# EAGLE schematic BoosterHC HAT V0_1 (EAGLE 8.1.0)
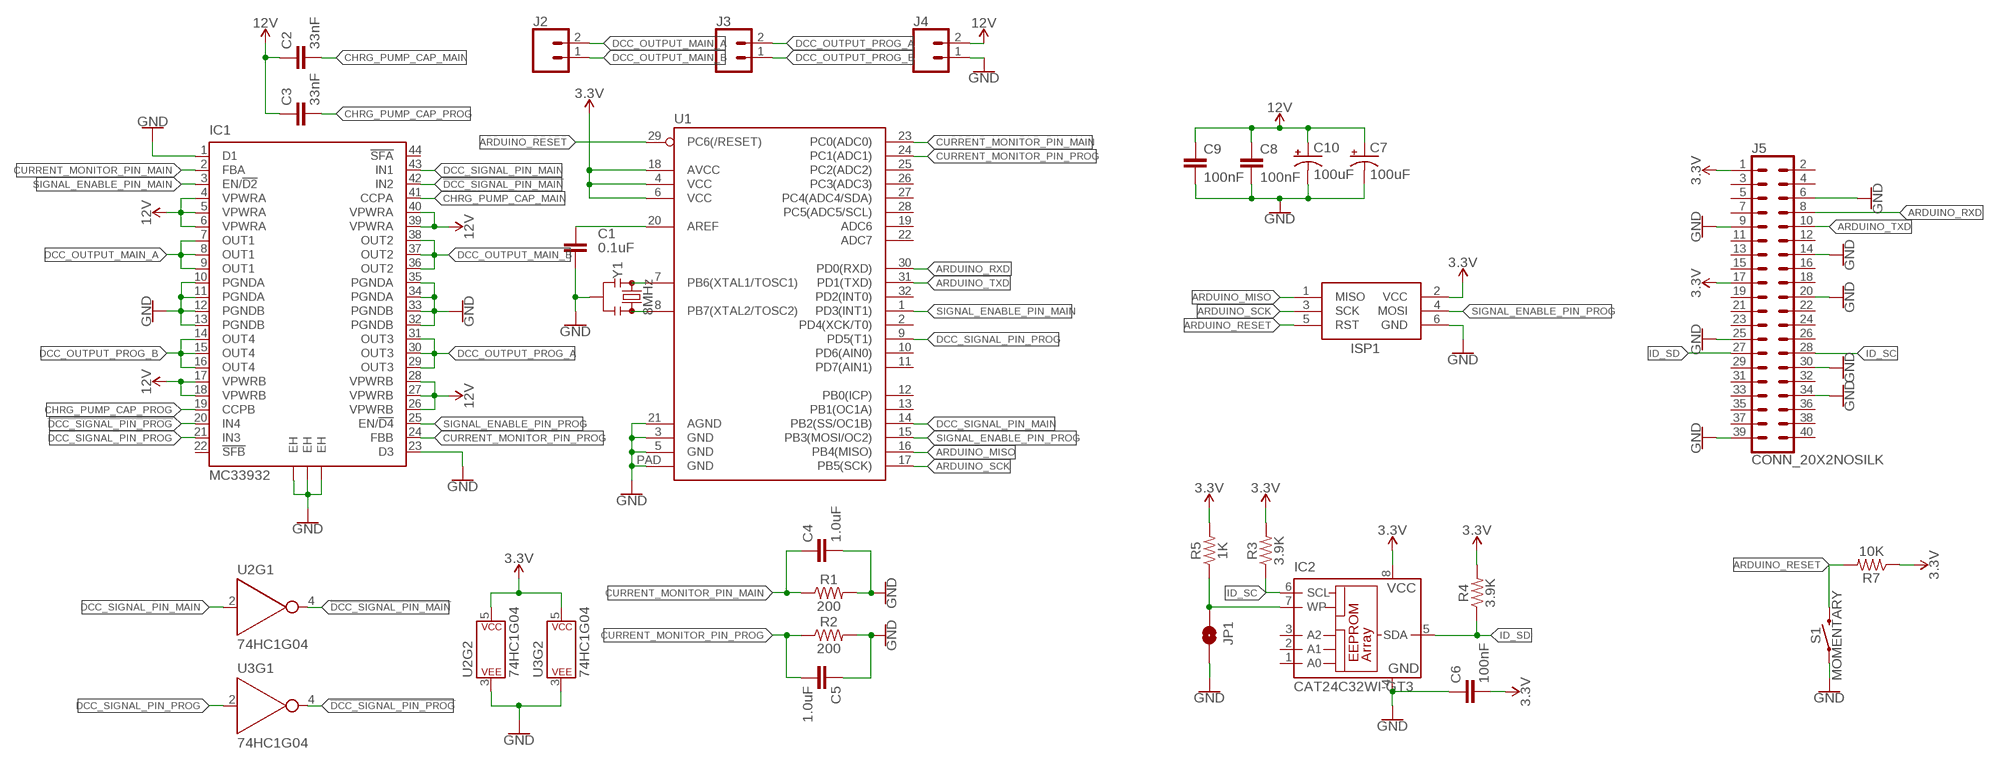
[diagram p0: schematic, sheet 1]

## Parts
C1  0.1uF  0.1UF-0603-25V-5%  [0603]
C2  33nF  33NF-0603-50V-10%  [0603]
C3  33nF  33NF-0603-50V-10%  [0603]
C4  1.0uF  1.0UF-0603-16V-10%  [0603]
C5  1.0uF  1.0UF-0603-16V-10%  [0603]
C6  100nF  33NF-0603-50V-10%  [0603]
C7  100uF  100UF-POLAR-25V-20%(ELEC)  [PANASONIC_D]
C8  100nF  47NF-0603-25V-5%  [0603]
C9  100nF  47NF-0603-25V-5%  [0603]
C10  100uF  100UF-POLAR-25V-20%(ELEC)  [PANASONIC_D]
IC1  MC33932  [HSOP44]
IC2  CAT24C32WI-GT3  24C32ASN  [SO-08]
ISP1  AVRISP-6  [AVRISP]
J2  CONN_025MM  [SCREWTERMINAL-5MM-2]
J3  CONN_025MM  [SCREWTERMINAL-5MM-2]
J4  CONN_025MM  [SCREWTERMINAL-5MM-2]
J5  CONN_20X2NOSILK  [2X20_NOSILK]
JP1  JUMPER-SMT_2_NO_SILK  [SMT-JUMPER_2_NO_SILK]
R1  200  200OHM-0603-1/10W-1%  [0603]
R2  200  200OHM-0603-1/10W-1%  [0603]
R3  3.9K  200OHM-0603-1/10W-1%  [0603]
R4  3.9K  200OHM-0603-1/10W-1%  [0603]
R5  1K  200OHM-0603-1/10W-1%  [0603]
R7  10K  200OHM-0603-1/10W-1%  [0603]
S1  MOMENTARY  MOMENTARY-SWITCH-SPST-SMD-5.2-REDUNDANT  [TACTILE_SWITCH_SMD_5.2MM]
U1  ATMEGA328P_MLFMLF32  [MLF32-PAD]
U2  74HC1G04  [SOT353]
U3  74HC1G04  [SOT353]
Y1  8MHz  RESONATOR-8MHZSMD_3.2X1.3  [RESONATOR-SMD-3.2X1.3]

## Nets
3.3V: C6.2 IC2.8(VCC) ISP1.2(VCC) J5.1 J5.17 R3.2 R4.2 R5.2 R7.1 U1.4(VCC) U1.6(VCC) U1.18(AVCC) U2.5(P$V+) U3.5(P$V+)
12V: C2.1 C3.1 C7.+ C8.1 C9.1 C10.+ IC1.4(VPWRA) IC1.5(VPWRA) IC1.6(VPWRA) IC1.17(VPWRB) IC1.18(VPWRB) IC1.26(VPWRB) IC1.27(VPWRB) IC1.28(VPWRB) IC1.39(VPWRA) IC1.40(VPWRA) J4.2
!DCC_SIGNAL_PIN_MAIN: IC1.42(IN2) U2.4(Y)
!DCC_SIGNAL_PIN_PROG: IC1.20(IN4) U3.4(Y)
ARDUINO_MISO: ISP1.1(MISO) U1.16(PB4(MISO))
ARDUINO_RESET: ISP1.5(RST) R7.2 S1.3 S1.4 U1.29(PC6(/RESET))
ARDUINO_RXD: J5.8 U1.30(PD0(RXD))
ARDUINO_SCK: ISP1.3(SCK) U1.17(PB5(SCK))
ARDUINO_TXD: J5.10 U1.31(PD1(TXD))
CHRG_PUMP_CAP_MAIN: C2.2 IC1.41(CCPA)
CHRG_PUMP_CAP_PROG: C3.2 IC1.19(CCPB)
CURRENT_MONITOR_PIN_MAIN: C4.1 IC1.2(FBA) R1.1 U1.23(PC0(ADC0))
CURRENT_MONITOR_PIN_PROG: C5.2 IC1.24(FBB) R2.1 U1.24(PC1(ADC1))
DCC_OUTPUT_MAIN_A: IC1.7(OUT1) IC1.8(OUT1) IC1.9(OUT1) J2.2
DCC_OUTPUT_MAIN_B: IC1.36(OUT2) IC1.37(OUT2) IC1.38(OUT2) J2.1
DCC_OUTPUT_PROG_A: IC1.29(OUT3) IC1.30(OUT3) IC1.31(OUT3) J3.2
DCC_OUTPUT_PROG_B: IC1.14(OUT4) IC1.15(OUT4) IC1.16(OUT4) J3.1
DCC_SIGNAL_PIN_MAIN: IC1.43(IN1) U1.14(PB2(SS/OC1B)) U2.2(A)
DCC_SIGNAL_PIN_PROG: IC1.21(IN3) U1.9(PD5(T1)) U3.2(A)
GND: C1.2 C4.2 C5.1 C6.1 C7.- C8.2 C9.2 C10.- IC1.1(D1) IC1.10(PGNDA) IC1.11(PGNDA) IC1.12(PGNDB) IC1.13(PGNDB) IC1.23(D3) IC1.32(PGNDB) IC1.33(PGNDB) IC1.34(PGNDA) IC1.35(PGNDA) IC1.EH@1(EH) IC1.EH@2(EH) IC1.EH@3(EH) IC2.4(GND) ISP1.6(GND) J4.1 J5.6 J5.9 J5.14 J5.20 J5.25 J5.30 J5.34 J5.39 JP1.2 R1.2 R2.2 S1.1 S1.2 U1.3(GND) U1.5(GND) U1.21(AGND) U1.PAD(GND) U2.3(P$V-) U3.3(P$V-) Y1.2
ID_SC: IC2.6(SCL) J5.28 R3.1
ID_SD: IC2.5(SDA) J5.27 R4.1
N$4: IC2.7(WP) JP1.1 R5.1
N$7: U1.8(PB7(XTAL2/TOSC2)) Y1.3
N$8: U1.7(PB6(XTAL1/TOSC1)) Y1.1
N$9: C1.1 U1.20(AREF)
SIGNAL_ENABLE_PIN_MAIN: IC1.3(EN/!D2) U1.1(PD3(INT1))
SIGNAL_ENABLE_PIN_PROG: IC1.25(EN/!D4) ISP1.4(MOSI) U1.15(PB3(MOSI/OC2))
Unconnected: IC1.22(!SFB) IC1.44(!SFA) IC2.1(A0) IC2.2(A1) IC2.3(A2) J5.2 J5.3 J5.4 J5.5 J5.7 J5.11 J5.12 J5.13 J5.15 J5.16 J5.18 J5.19 J5.21 J5.22 J5.23 J5.24 J5.26 J5.29 J5.31 J5.32 J5.33 J5.35 J5.36 J5.37 J5.38 J5.40 U1.2(PD4(XCK/T0)) U1.10(PD6(AIN0)) U1.11(PD7(AIN1)) U1.12(PB0(ICP)) U1.13(PB1(OC1A)) U1.19(ADC6) U1.22(ADC7) U1.25(PC2(ADC2)) U1.26(PC3(ADC3)) U1.27(PC4(ADC4/SDA)) U1.28(PC5(ADC5/SCL)) U1.32(PD2(INT0))

## Library data of the parts
C1 = SparkFun-Capacitors:0.1UF: 0.1µF ceramic capacitors A capacitor is a passive two-terminal electrical component used to store electrical energy temporarily in an electric field.; PROD_ID: CAP-08604
C2 C3 = SparkFun-Capacitors:33NF: 33nF ceramic capacitors A capacitor is a passive two-terminal electrical component used to store electrical energy temporarily in an electric field.; PROD_ID: CAP-07887
C4 C5 = SparkFun-Capacitors:1.0UF: 1µF ceramic capacitors A capacitor is a passive two-terminal electrical component used to store electrical energy temporarily in an electric field.; PROD_ID: CAP-00868
C6 = SparkFun-Capacitors:33NF: 33nF ceramic capacitors A capacitor is a passive two-terminal electrical component used to store electrical energy temporarily in an electric field.; PROD_ID: CAP-07887; VALUE: 33nF
C7 C10 = SparkFun-Capacitors:100UF-POLAR: 100µF polarized capacitors A capacitor is a passive two-terminal electrical component used to store electrical energy temporarily in an electric field.; PROD_ID: CAP-12547
C8 C9 = SparkFun-Capacitors:47NF: 47nF ceramic capacitors A capacitor is a passive two-terminal electrical component used to store electrical energy temporarily in an electric field.; PROD_ID: CAP-08605; VALUE: 47nF
IC1 = freescale:MC33932: 5.0 A Throttle Control H-Bridge Auto generated by make-symbol-device-package-bsdl.ulp Rev. 33 Source: http://www.freescale.com/files/analog/doc/data_sheet/MC33932.pdf?fpsp=1; MPN: MC33932VW; OC_FARNELL: 1701639; OC_NEWARK: 67P3304
IC2 = microchip:24*: Serial EEPROM I2C; MPN: IS24C32A-2GLI; OC_FARNELL: 1224413; OC_NEWARK: 43M4588
ISP1 = adafruit:AVRISP: AVR ISP HEADER Standard 6 pin header for AVR programming
J2-J4 = SparkFun-Connectors:CONN_02: Multi connection point. Often used as Generic Header-pin footprint for 0.1 inch spaced/style header connections On any of the 0.1 inch spaced packages, you can populate with these: Break Away Headers - Straight <https://www.sparkfun.com/products/116> (PRT-00116) Break Away Male Headers - Right Angle <https://www.sparkfun.com/products/553> (PRT-00553) Female Headers <https://www.sparkfun.com/products/115> (PRT-00115) Break Away Headers - Machine Pin <https://www.sparkfun.com/products/117> (PRT-00117) Break Away Female Headers - Swiss Machine Pin <https://www.sparkfun.com/products/743> (PRT-00743) For SCREWTERMINALS and SPRING TERMINALS visit here: Screw Terimnals on SparkFun.com <https://www.sparkfun.com/search/results?term=Screw+Terminals> (5mm/3.5mm/2.54mm spacing) This device is also useful as a general connection point to wire up your design to another part of your project. Our various solder wires solder well into these plated through hole pads. Hook-Up Wire - Assortment (Stranded, 22 AWG) <https://www.sparkfun.com/products/11375> (PRT-11375) Hook-Up Wire - Assortment (Solid Core, 22 AWG) <https://www.sparkfun.com/products/11367> (PRT-11367) View the entire wire category on our website here <https://www.sparkfun.com/categories/141> Special notes: Molex polarized connector foot print use with: PRT-08233 with associated crimp pins and housings. 2.54_SCREWTERM for use with PRT-10571. 3.5mm Screw Terminal footprints for PRT-08084 5mm Screw Terminal footprints for use with PRT-08432; SF_SKU: PRT-08432
J5 = SparkFun-Connectors:CONN_20X2: Multi connection point. Often used as Generic Header-pin footprint for 0.1 inch spaced/style header connections On any of the 0.1 inch spaced packages, you can populate with these: Break Away Headers - Straight <https://www.sparkfun.com/products/116> (PRT-00116) Break Away Male Headers - Right Angle <https://www.sparkfun.com/products/553> (PRT-00553) Female Headers <https://www.sparkfun.com/products/115> (PRT-00115) Break Away Headers - Machine Pin <https://www.sparkfun.com/products/117> (PRT-00117) Break Away Female Headers - Swiss Machine Pin <https://www.sparkfun.com/products/743> (PRT-00743)
JP1 = SparkFun-Jumpers:JUMPER-SMT_2_NO: Normally open jumper This jumper has two pads in close proximity to each other. Apply solder to close the connection. Round pads are easier to solder for beginners, but are a lot larger. SparkFun Product that uses the round pads: SparkFun EL Sequencer <https://www.sparkfun.com/products/12781>
R1 R2 = SparkFun-Resistors:200OHM: 200Ω resistor A resistor is a passive two-terminal electrical component that implements electrical resistance as a circuit element. Resistors act to reduce current flow, and, at the same time, act to lower voltage levels within circuits. - Wikipedia; PROD_ID: RES-08220
R3-R5 R7 = SparkFun-Resistors:200OHM: 200Ω resistor A resistor is a passive two-terminal electrical component that implements electrical resistance as a circuit element. Resistors act to reduce current flow, and, at the same time, act to lower voltage levels within circuits. - Wikipedia; PROD_ID: RES-08220; VALUE: 200
S1 = SparkFun-Switches:MOMENTARY-SWITCH-SPST: Momentary Switch (Pushbutton) - SPST Normally-open (NO) SPST momentary switches (buttons, pushbuttons). Variants PTH-12MM - 12mm square, through-hole Momentary Pushbutton Switch - 12mm Square <https://www.sparkfun.com/products/9190> (COM-09190) PTH-6.0MM, PTH-6.0MM-KIT - 6.0mm square, through-hole Mini Pushbutton Switch <https://www.sparkfun.com/products/97> (COM-00097) KIT package intended for soldering kit's - only one side of pads' copper is exposed. PTH-RIGHT-ANGLE-KIT - Right-angle, through-hole Right Angle Tactile Button <https://www.sparkfun.com/products/10791> - Used on SparkFun BigTime Watch Kit <https://www.sparkfun.com/products/11734> SMD-12MM - 12mm square, surface-mount Tactile Button - SMD (12mm) <https://www.sparkfun.com/products/12993> (COM-12993) Used on SparkFun PicoBoard <https://www.sparkfun.com/products/11888> SMD-4.5MM - 4.5mm Square Trackball Switch Used on SparkFun Blackberry Trackballer Breakout <https://www.sparkfun.com/products/13169> SMD-4.6MMX2.8MM - 4.60mm x 2.80mm, surface mount Used on SparkFun SAMD21 Mini Breakout <https://www.sparkfun.com/products/13664> SMD-5.2MM, SMD-5.2-REDUNDANT - 5.2mm square, surface-mount Mini Pushbutton Switch - SMD <https://www.sparkfun.com/products/8720> (COM-08720) Used on Arduino Pro Mini <https://www.sparkfun.com/products/11114> REDUNDANT package connects both switch circuits together SMD-6.0X3.5MM - 6.0 x 3.5mm, surface mount Momentary Reset Switch SMD <https://www.sparkfun.com/products/8229> (COM-08229) SMD-6.2MM-TALL - 6.2mm square, surface mount Tactile Button - SMD (6mm) <https://www.sparkfun.com/products/12992> Used on SparkFun Digital Sandbox <https://www.sparkfun.com/products/12651> SMD-RIGHT-ANGLE - Right-angle, surface mount Used on SparkFun Block for Intel® Edison - Arduino <https://www.sparkfun.com/products/13036>; PROD_ID: SWCH-08247; SF_SKU: COM-08720
U1 = SparkFun-IC-Microcontroller:ATMEGA328P_MLF: Datasheet SparkFun Products () () 32-Pin Atmega328 part Commonly used on Arduino compatible boards Available in QFP and QFN packages TQFP is IC-09069 QFN is non-stock
U2 U3 = SparkFun-IC-Logic:74*1G04: Single Inverter IC NOT GATE INVERTER SNGL 1IN SOT353 Supply: 1.65V to 5.5V Datasheet <http://diodes.com/datasheets/74LVC1G04.pdf> SparkFun Products SparkFun Stepoko <https://www.sparkfun.com/products/13899> (ROB-13899) SparkFun CryptoShield <https://www.sparkfun.com/products/13183> (DEV-13183) SparkFun LogicBlocks Kit <https://www.sparkfun.com/products/11006> (KIT-11006) SparkFun ArduMoto <https://www.sparkfun.com/products/9815> (DEV-09815); PROD_ID: COMP-08268
Y1 = SparkFun-Clocks:RESONATOR-8MHZ: 8MHz Resonator Digikey Example <http://www.digikey.com/product-detail/en/murata-electronics-north-america/CSTCE10M0G55-R0/490-1196-1-ND/584633> Frequency: 8MHz Frequency Stability: ±0.2% Frequency Tolerance: ±0.5% Capacitance: 33pF SparkFun Products Arduino Pro Mini 328- 3.3V/8MHz <https://www.sparkfun.com/products/11114> SparkFun Digital Sandbox <https://www.sparkfun.com/products/12651>; PROD_ID: XTAL-08895